# Altium schematic sheet Sheet_1_2022-01-22.schdoc
size 48 x 38 mm
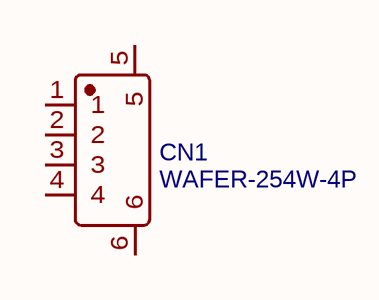
[diagram p0: Sheet_1_2022-01-22.schdoc]

## Parts
CN1  WAFER-254W-4P  [CONN-SMD_4P-P2.50-WAFER-254W-4P]

## Nets

Not connected (* = marked no-connect by the designer): CN1 1 2 3 4 5 6

## Library data of the parts
CN1 = WAFER-254W-4P: BOM_Manufacturer: XUNPU(讯普); Contributor: LCSC; BOM_Supplier: LCSC; BOM_Supplier Part: C2856745; BOM_Manufacturer Part: WAFER-254W-4P; BOM_JLCPCB Part Class: Extended Part; spicePre: C; spiceSymbolName: WAFER-254W-4P